# Altium schematic sheet SWITCHING.SchDoc
size A4
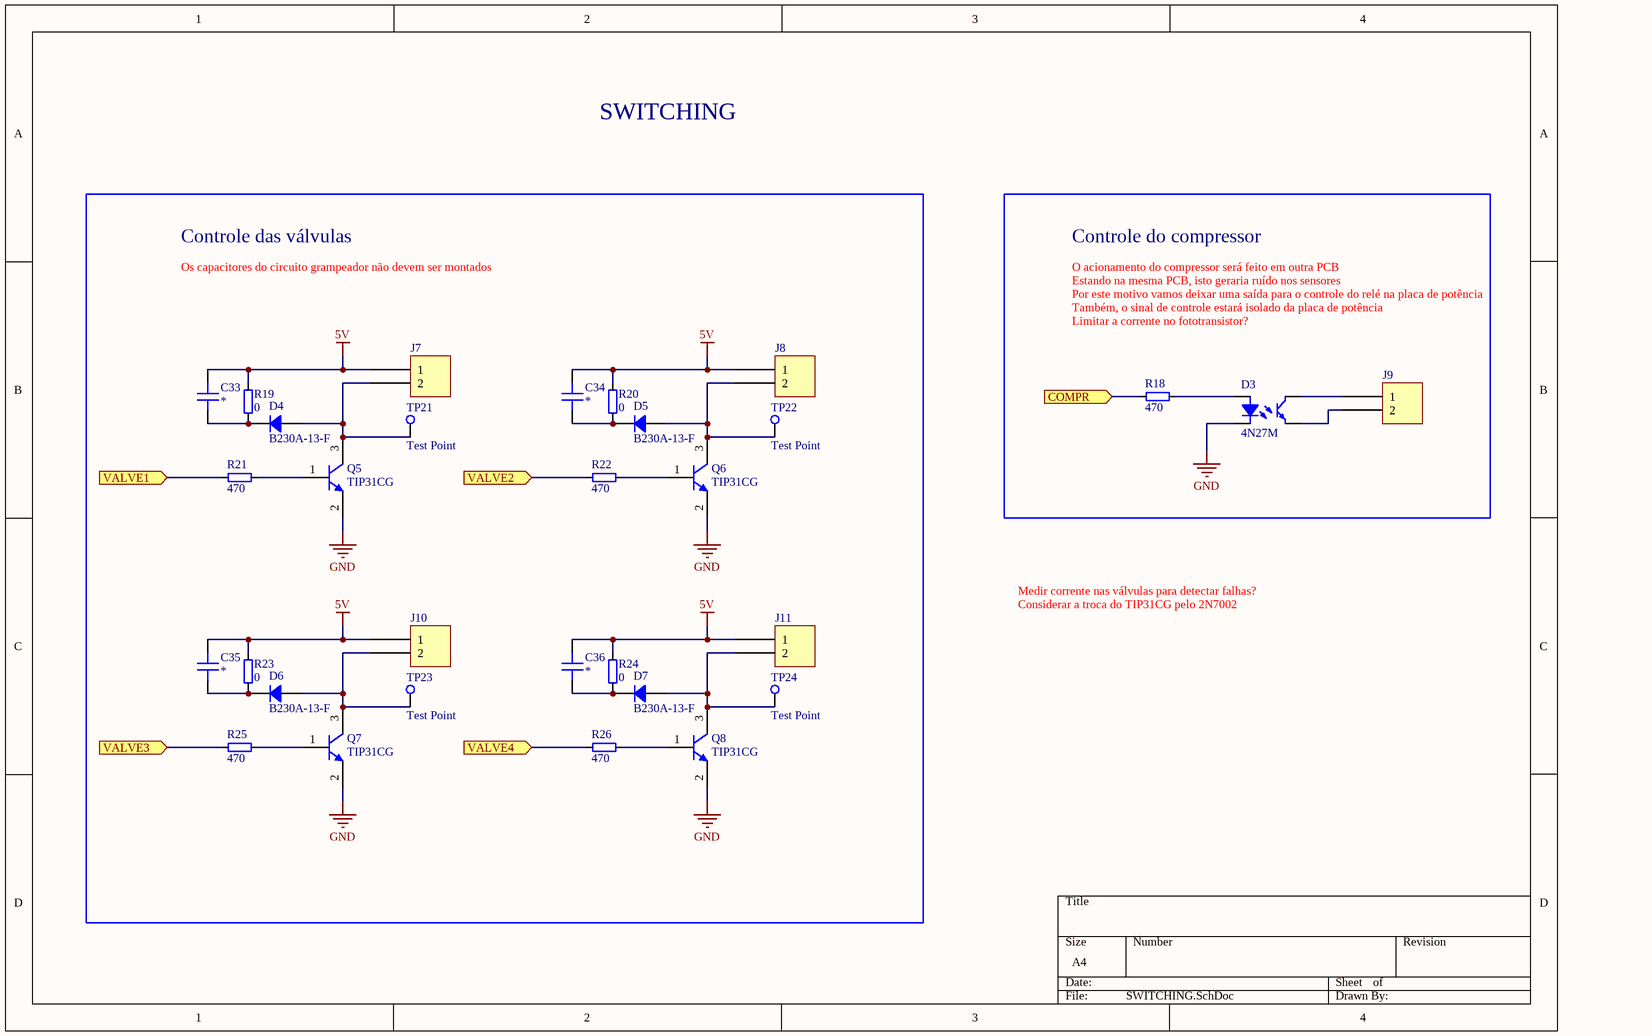
[diagram p0: SWITCHING.SchDoc]

## Parts
C33  *  [C_0805]
C34  *  [C_0805]
C35  *  [C_0805]
C36  *  [C_0805]
D3  4N27M  [DIP6]
D4  B230A-13-F  [DO-214AC]
D5  B230A-13-F  [DO-214AC]
D6  B230A-13-F  [DO-214AC]
D7  B230A-13-F  [DO-214AC]
J7  Term Block 2 Pin 2.54mm  [TERM_BLOCK2PIN]  (value not drawn)
J8  Term Block 2 Pin 2.54mm  [TERM_BLOCK2PIN]  (value not drawn)
J9  Term Block 2 Pin 2.54mm  [TERM_BLOCK2PIN]  (value not drawn)
J10  Term Block 2 Pin 2.54mm  [TERM_BLOCK2PIN]  (value not drawn)
J11  Term Block 2 Pin 2.54mm  [TERM_BLOCK2PIN]  (value not drawn)
Q5  TIP31CG  [TO-220]
Q6  TIP31CG  [TO-220]
Q7  TIP31CG  [TO-220]
Q8  TIP31CG  [TO-220]
R18  470  [R_0805]
R19  0  [R_0805]
R20  0  [R_0805]
R21  470  [R_0805]
R22  470  [R_0805]
R23  0  [R_0805]
R24  0  [R_0805]
R25  470  [R_0805]
R26  470  [R_0805]
TP21  Test Point  [Test_Point]
TP22  Test Point  [Test_Point]
TP23  Test Point  [Test_Point]
TP24  Test Point  [Test_Point]

## Blocks framed on the sheet
Controle das válvulas: C33-C36 D4-D7 J7 J8 J10 J11 Q5-Q8 R19-R26 TP21-TP24
Controle do compressor: D3 J9 R18

## Ports
COMPR (in), VALVE1 (in), VALVE2 (in), VALVE3 (in), VALVE4 (in)

## Nets
5V: C33.2 C34.2 C35.2 C36.2 J7.1 J8.1 J10.1 J11.1 R19.2 R20.2 R23.2 R24.2
GND: D3.2 Q5.2(E) Q6.2(E) Q7.2(E) Q8.2(E)
COMPR: R18.1 ; port COMPR
VALVE1: R21.1 ; port VALVE1
VALVE2: R22.1 ; port VALVE2
VALVE3: R25.1 ; port VALVE3
VALVE4: R26.1 ; port VALVE4
NetC33_1: C33.1 D4.2 R19.1
NetC34_1: C34.1 D5.2 R20.1
NetC35_1: C35.1 D6.2 R23.1
NetC36_1: C36.1 D7.2 R24.1
NetD3_1: D3.1 R18.2
NetD3_3: D3.3 J9.2
NetD3_4: D3.4 J9.1
NetD4_1: D4.1 J7.2 Q5.3(C) TP21.1(TP)
NetD5_1: D5.1 J8.2 Q6.3(C) TP22.1(TP)
NetD6_1: D6.1 J10.2 Q7.3(C) TP23.1(TP)
NetD7_1: D7.1 J11.2 Q8.3(C) TP24.1(TP)
NetQ5_1: Q5.1(B) R21.2
NetQ6_1: Q6.1(B) R22.2
NetQ7_1: Q7.1(B) R25.2
NetQ8_1: Q8.1(B) R26.2

## Notes on the sheet
- SWITCHING
- Os capacitores do circuito grampeador não devem ser montados
- O acionamento do compressor será feito em outra PCB
- Estando na mesma PCB, isto geraria ruído nos sensores
- Por este motivo vamos deixar uma saída para o controle do relé na placa de potência
- Também, o sinal de controle estará isolado da placa de potência
- Limitar a corrente no fototransistor?
- Medir corrente nas válvulas para detectar falhas?
- Considerar a troca do TIP31CG pelo 2N7002

## Library data of the parts
C33-C36 = C_0805: Generic SMD 0805 Capacitor; Value: *; Voltage: *; Datasheet: *; Manufacturer: *; Supplier: *; Temperature: *; Part Number: *
D3 = Optocoupler 4N27M: 4N27M OPTOCOUPLER TRANS-OUT 6-DIP; Part Number: 4N27M; Datasheet: https://br.mouser.com/datasheet/2/239/775704_1-1175530.pdf; Supplier: https://br.mouser.com/ProductDetail/Lite-On/4N27M?qs=gnaPJ2cis710wpcgziU08w%3D%3D
D4-D7 = DIODE_B230A-13-F: DIODE SCHOTTKY 30V 2A SMA; Part Number: B230A-13-F; Supplier: https://br.mouser.com/ProductDetail/Diodes-Incorporated/B230A-13-F?qs=CWr0IvVDl%2FzIzEFfZQUtSw%3D%3D; Datasheet: https://br.mouser.com/datasheet/2/115/ds13004-70120.pdf; Voltage: 30V; Power: *
J7-J11 = TERM BLOCK 2 PIN_1: CONN TERM BLOCK 2.54MM 2POS 125V 6A; Datasheet: https://media.digikey.com/pdf/Data%20Sheets/Phoenix%20Contact%20PDFs/1725656_Ds.pdf; Supplier: https://www.digikey.com/product-detail/en/phoenix-contact/1725656/277-1273-ND/267462
Q5-Q8 = TRANS_TIP31CG: BJT 3A 100V 40W NPN; Part Number: TIP31CG; Datasheet: https://www.onsemi.com/pub/Collateral/TIP31A-D.PDF; Supplier: https://br.mouser.com/ProductDetail/?qs=xZq1yRCsb1d0GJkceBxz7Q%3D%3D
R18 R21 R22 R25 R26 = R_0805_ERJ-6ENF4700V: RES 470 OHM 1/8W 1% 0805 SMD; Manufacturer: Panasonic - ECG; Voltage: 150V; Value: 470; Supplier: https://br.mouser.com/ProductDetail/Panasonic/ERJ-6ENF4700V?qs=haJlXwgIYR1%252BMvNjPRrlhw%3D%3D; Datasheet: https://br.mouser.com/datasheet/2/315/AOA0000C304-1149620.pdf; Temperature: -55 to 155 ºC; Part Number: ERJ-6ENF4700V
R19 R20 R23 R24 = R_0805_ERJ-6GEY0R00V: RES 0 OHM 1/8W 1% 0805 SMD; Manufacturer: Panasonic - ECG; Value: 0; Supplier: https://br.mouser.com/ProductDetail/Panasonic/ERJ-6GEY0R00V?qs=tQNqqtTOejLLHbaWAzeH1w%3D%3D; Datasheet: https://br.mouser.com/datasheet/2/315/AOA0000C301-1488782.pdf; Temperature: -55 to +155ºC; Part Number: ERJ-6GEY0R00V